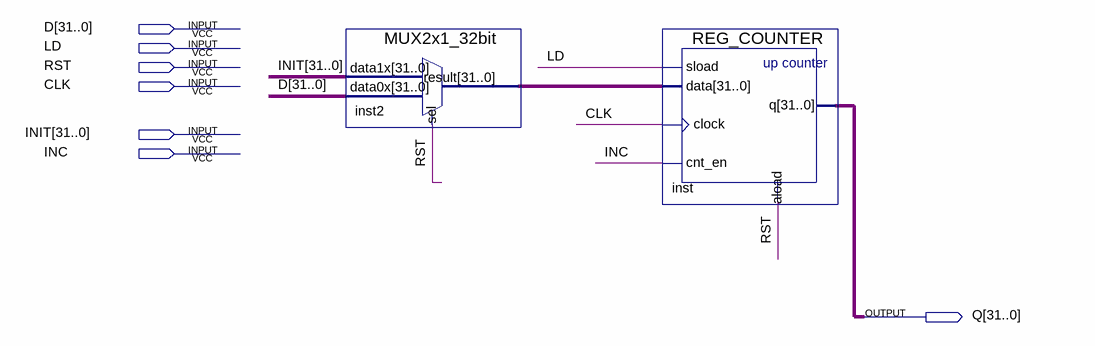
[diagram p0: schematic sheet]
// Quartus schematic reg32bit_universal.bdf as structural Verilog: 2 symbols, 7 pins
module reg32bit_universal (
  input  [31:0] D,
  input  LD,
  input  RST,
  input  CLK,
  input  [31:0] INIT,
  input  INC,
  output [31:0] Q
);

  wire [31:0] inst2_result;

  MUX2x1_32bit inst2 (.data1x(INIT), .data0x(D), .sel(RST), .result(inst2_result));
  REG_COUNTER inst (.sload(LD), .data(inst2_result), .clock(CLK), .cnt_en(INC), .aload(RST), .q(Q));
endmodule
